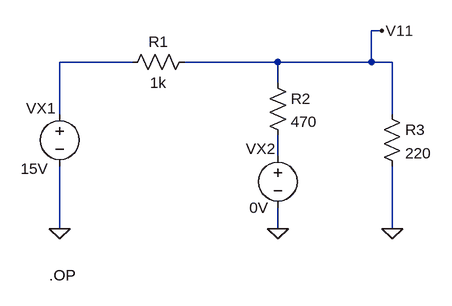
[diagram p0: schematic Cópia de Ex_00_AnaliseDC (1).asc]
Cópia de Ex_00_AnaliseDC (1).asc, the LTspice schematic file:
Version 4
SHEET 1 880 680
WIRE 320 16 304 16
WIRE -64 64 -176 64
WIRE 160 64 16 64
WIRE 304 64 304 16
WIRE 304 64 160 64
WIRE 336 64 304 64
WIRE 160 96 160 64
WIRE -176 144 -176 64
WIRE 336 144 336 64
WIRE 160 208 160 176
WIRE -176 320 -176 224
WIRE 160 320 160 288
WIRE 336 320 336 224
FLAG -176 320 0
FLAG 160 320 0
FLAG 336 320 0
FLAG 320 16 V11
SYMBOL res 144 80 R0
SYMATTR InstName R2
SYMATTR Value 470
SYMBOL res 320 128 R0
SYMATTR InstName R3
SYMATTR Value 220
SYMBOL res 32 48 R90
WINDOW 0 0 56 VBottom 0
WINDOW 3 32 56 VTop 0
SYMATTR InstName R1
SYMATTR Value 1k
SYMBOL voltage -176 128 R0
WINDOW 123 0 0 Left 0
WINDOW 39 0 0 Left 0
WINDOW 0 -52 7 Left 0
WINDOW 3 -60 100 Left 0
SYMATTR InstName VX1
SYMATTR Value 15V
SYMBOL voltage 160 192 R0
WINDOW 123 0 0 Left 0
WINDOW 39 0 0 Left 0
WINDOW 0 -49 5 Left 0
WINDOW 3 -44 96 Left 0
SYMATTR InstName VX2
SYMATTR Value 0V
TEXT -192 392 Left 0 !.OP

The netlist it stands for:
* Cópia de Ex_00_AnaliseDC (1).asc
R2 V11 N002 470
R3 V11 0 220
R1 V11 N001 1k
VX1 N001 0 15V
VX2 N002 0 0V
.OP
.backanno
.end